# Altium project Tracker_Prototype.PrjPcb
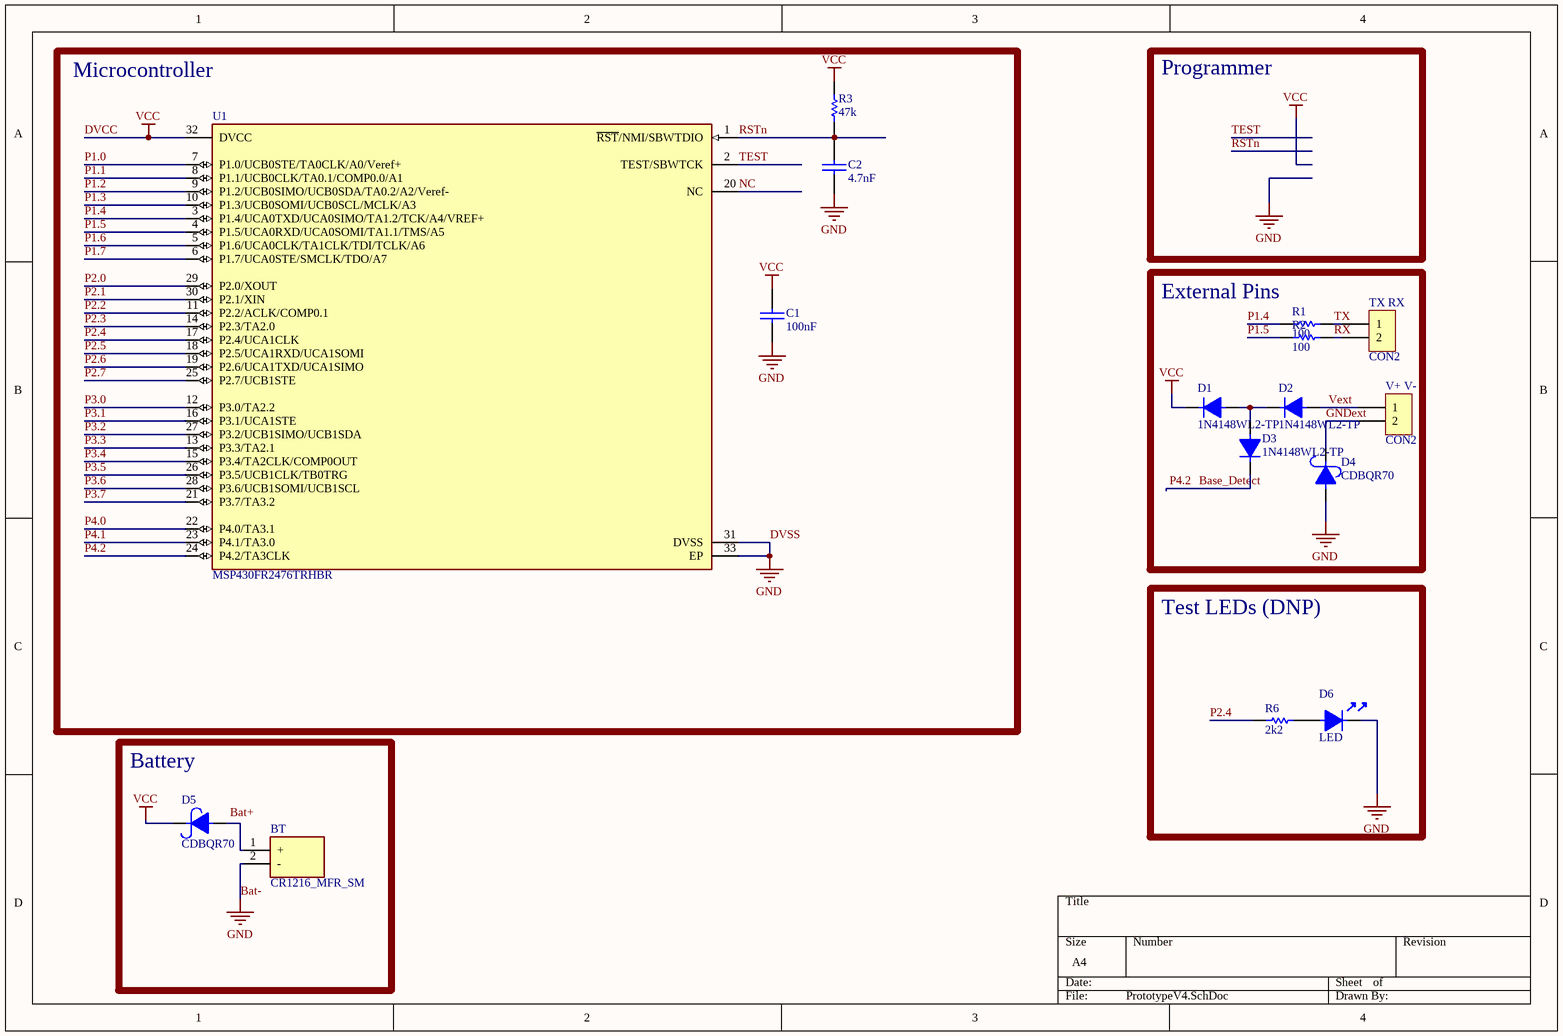
[diagram p0: PrototypeV4.SchDoc]
1 sheet, 16 parts. Net scope: global (net labels, ports and power ports of the same name join across sheets).
Board files: Prototype.PcbDoc, XTAL_tht.PcbDoc, PrototypeV2.PcbDoc, PrototypeV3.PcbDoc, PrototypeV4.PcbDoc

## Sheet PrototypeV4.SchDoc
size A4; SheetNumber: 1; SheetTotal: 1

### Parts
BT  CR1216_MFR_SM  [CR1216MFRSM]
C1  100nF  [0402-A]
C2  4.7nF  [0402-A]
D1  1N4148WL2-TP  [0402-A]
D2  1N4148WL2-TP  [0402-A]
D3  1N4148WL2-TP  [0402-A]
D4  CDBQR70  [0402-A]
D5  CDBQR70  [0402-A]
D6  LED  [0805]
R1  100  [0402-A]
R2  100  [0402-A]
R3  47k  [0402-A]
R6  2k2  [0402-A]
TX_RX  CON2  [SIP2]
U1  MSP430FR2476TRHBR  [FP-RHB0032E-IPC_A]
V+_V-  CON2  [SIP2]

### Blocks framed on the sheet
Microcontroller: C1 C2 R3 U1
External Pins: D1-D4 R1 R2 TX_RX V+_V-
Test LEDs (DNP): D6 R6
Battery: BT D5

### Nets
Bat-: BT.2(-) C1.2 C2.2 D4.1 D6.2 U1.31(DVSS) U1.33(EP)  [also labelled DVSS, GND]
DVCC: C1.1 D1.2 D5.2 R3.1 U1.32(DVCC)  [also labelled VCC]
Base_Detect: D3.2 U1.24(P4.2/TA3CLK)  [also labelled P4.2]
GNDext: D4.2 V+_V-.2
NC: U1.20(NC)
P1.0: U1.7(P1.0/UCB0STE/TA0CLK/A0/Veref+)
P1.1: U1.8(P1.1/UCB0CLK/TA0.1/COMP0.0/A1)
P1.2: U1.9(P1.2/UCB0SIMO/UCB0SDA/TA0.2/A2/Veref-)
P1.3: U1.10(P1.3/UCB0SOMI/UCB0SCL/MCLK/A3)
P1.4: R1.1 U1.3(P1.4/UCA0TXD/UCA0SIMO/TA1.2/TCK/A4/VREF+)
P1.5: R2.2 U1.4(P1.5/UCA0RXD/UCA0SOMI/TA1.1/TMS/A5)
P1.6: U1.5(P1.6/UCA0CLK/TA1CLK/TDI/TCLK/A6)
P1.7: U1.6(P1.7/UCA0STE/SMCLK/TDO/A7)
P2.0: U1.29(P2.0/XOUT)
P2.1: U1.30(P2.1/XIN)
P2.2: U1.11(P2.2/ACLK/COMP0.1)
P2.3: U1.14(P2.3/TA2.0)
P2.4: R6.2 U1.17(P2.4/UCA1CLK)
P2.5: U1.18(P2.5/UCA1RXD/UCA1SOMI)
P2.6: U1.19(P2.6/UCA1TXD/UCA1SIMO)
P2.7: U1.25(P2.7/UCB1STE)
P3.0: U1.12(P3.0/TA2.2)
P3.1: U1.16(P3.1/UCA1STE)
P3.2: U1.27(P3.2/UCB1SIMO/UCB1SDA)
P3.3: U1.13(P3.3/TA2.1)
P3.4: U1.15(P3.4/TA2CLK/COMP0OUT)
P3.5: U1.26(P3.5/UCB1CLK/TB0TRG)
P3.6: U1.28(P3.6/UCB1SOMI/UCB1SCL)
P3.7: U1.21(P3.7/TA3.2)
P4.0: U1.22(P4.0/TA3.1)
P4.1: U1.23(P4.1/TA3.0)
RSTn: C2.1 R3.2 U1.1(~{RST}/NMI/SBWTDIO)
RX: R2.1 TX_RX.2
TEST: U1.2(TEST/SBWTCK)
TX: R1.2 TX_RX.1
Vext: D2.1 V+_V-.1
NetBT_1: BT.1(+) D5.1
NetD1_1: D1.1 D2.2 D3.1
NetD6_1: D6.1 R6.1

### Notes on the sheet
- Programmer
- Labels drawn without touching a wire or pin: Bat+

### Library data of the parts
BT = CR1216_MFR_SM: Battery; Manufacturer_Name: RENATA; Manufacturer_Part_Number: CR1216 MFR SM; Datasheet Link: https://www.renatabatteries.us/products/batteries/lithium-coin-tabbed/cr1216-mfr-sm; Height: 2.1mm; Mouser Part Number: 614-CR1216-MFR-SM; Mouser Price/Stock: https://www.mouser.co.uk/ProductDetail/Renata/CR1216-MFR-SM?qs=4nVQHMCMxQx0A4GUuQVNLg%3D%3D
C1 = CAP: CL05B104KP5VPNC
C2 = CAP: C0402C472K5RECAUTO
D1-D3 = DIODO
D4 D5 = DIODO SCHOTTKY: CDBQR70 / DIODE SCHOTTKY 70V 70MA 0402 / Current - Reverse Leakage @ Vr / 100 nA @ 50 V
D6 = LED: LED GREEN CLEAR 2012 SMD
R1 R2 = RES: RC0402FR-07100RL
R3 = RES: ERJ-2GEJ473X
R6 = RES: RC0402FR-072K2L
U1 = CMP-04869-000099-1: IC MCU 16BIT 64.5KB FRAM 32VQFN